# Altium schematic sheet Sheet5_Pin_Headers.SchDoc: JJGEEX_Homie_POC1
size Legal; Author: Jonas Cooper; CompanyName: JJ-GEEX; DrawnBy: Jonas Cooper; Organization: Homie Secure Smarthome; Address1: -; Address2: CU Boulder ECEE; Address3: -; Address4: Capstone; DocumentNumber: 1; Revision: 1; SheetNumber: 4; SheetTotal: 4
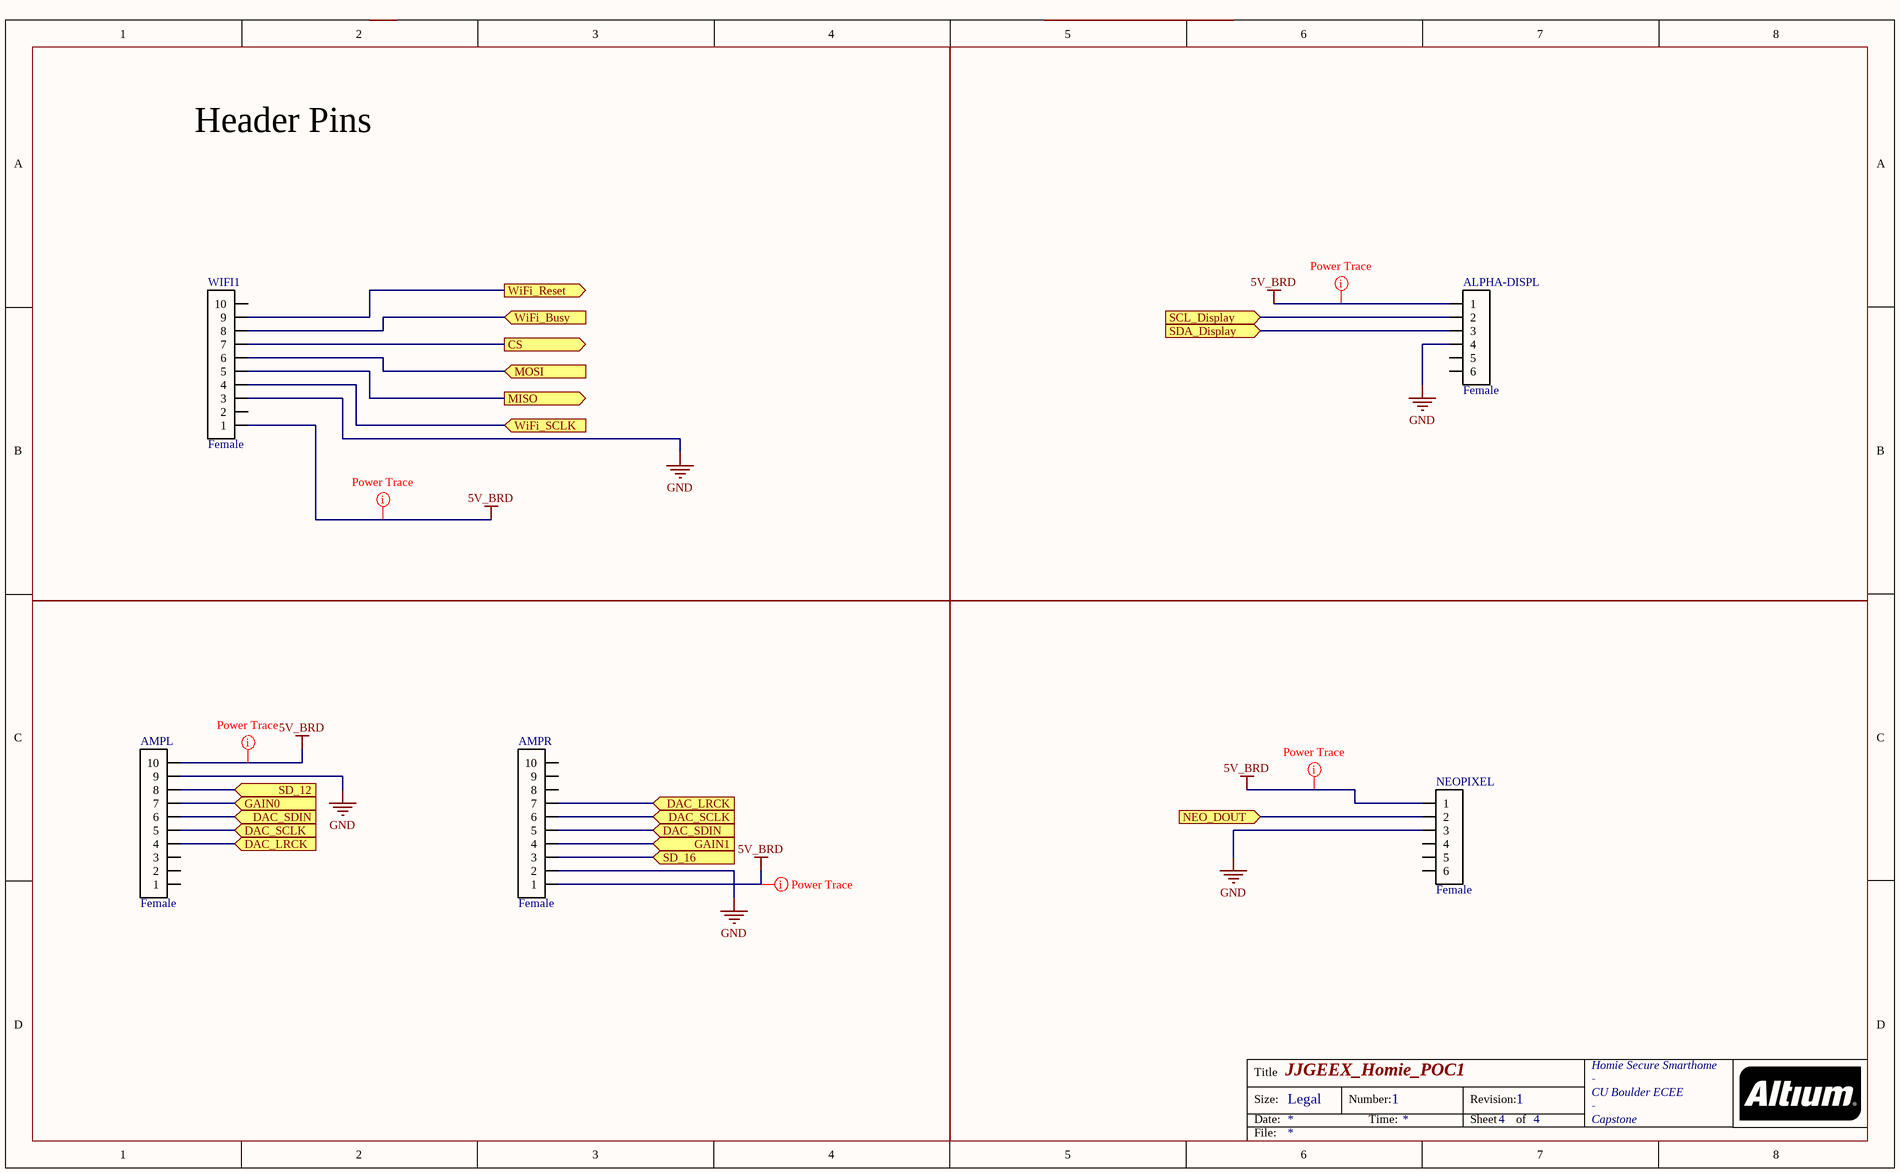
[diagram p0: Sheet5_Pin_Headers.SchDoc]

## Parts
ALPHA-DISPL  value Female  [6_PIN_100MIL]  (hidden comment: PPTC061LFBN-RC)
AMPL  value Female  [10_PIN_100MIL]  (hidden comment: PPTC101LFBN-RC)
AMPR  value Female  [10_PIN_100MIL]  (hidden comment: PPTC101LFBN-RC)
NEOPIXEL  value Female  [6_PIN_100MIL]  (hidden comment: PPTC061LFBN-RC)
WIFI1  value Female  [10_PIN_100MIL]  (hidden comment: PPTC101LFBN-RC)

## Blocks framed on the sheet
Header Pins: WIFI1

## Ports
CS (out), DAC_LRCK (in), DAC_SCLK (in), DAC_SDIN (in), GAIN0 (in), GAIN1 (in), MISO (out), MOSI (in), NEO_DOUT (in), SCL_Display (in), SD_12 (in), SD_16 (in), SDA_Display (in), WiFi_Busy (in), WiFi_Reset (out), WiFi_SCLK (in)

## Nets
5V_BRD: ALPHA-DISPL.1 AMPL.10 AMPR.1 NEOPIXEL.1 WIFI1.1
GND: ALPHA-DISPL.4 AMPL.9 AMPR.2 NEOPIXEL.3 WIFI1.3
CS: WIFI1.7 ; port CS
DAC_LRCK: AMPL.4 AMPR.7 ; port DAC_LRCK
DAC_SCLK: AMPL.5 AMPR.6 ; port DAC_SCLK
DAC_SDIN: AMPL.6 AMPR.5 ; port DAC_SDIN
GAIN0: AMPL.7 ; port GAIN0
GAIN1: AMPR.4 ; port GAIN1
MISO: WIFI1.5 ; port MISO
MOSI: WIFI1.6 ; port MOSI
NEO_DOUT: NEOPIXEL.2 ; port NEO_DOUT
SCL_Display: ALPHA-DISPL.2 ; port SCL_Display
SD_12: AMPL.8 ; port SD_12
SD_16: AMPR.3 ; port SD_16
SDA_Display: ALPHA-DISPL.3 ; port SDA_Display
WiFi_Busy: WIFI1.8 ; port WiFi_Busy
WiFi_Reset: WIFI1.9 ; port WiFi_Reset
WiFi_SCLK: WIFI1.4 ; port WiFi_SCLK

Not connected (* = marked no-connect by the designer): ALPHA-DISPL 5 6; AMPL 1 2 3; AMPR 8 9 10; NEOPIXEL 4 5 6; WIFI1 2 10

## Layout directives
rule Width Constraint [Pref Width = 13mil    Min Width = 6mil    Max Width = 100mil]: 5V_BRD

## Notes on the sheet
- Title
- Size:
- Date:
- Legal
- Number:
- Time:
- Revision:
- Sheet
- of
- File:

## Library data of the parts
ALPHA-DISPL NEOPIXEL = JF_6_PIN_FEMALE: 6 Position Header Connector 0.100" (2.54mm) Through Hole Tin; Digikey Link: https://www.digikey.com/product-detail/en/PPTC061LFBN-RC/S7004-ND/810145/?itemSeq=304982353; Digikey Part: S7004-ND
AMPL AMPR WIFI1 = JF_10_PIN_FEMALE: 10 Position Header Connector 0.100" (2.54mm) Through Hole Tin; Digikey Link: https://www.digikey.com/product-detail/en/PPTC101LFBN-RC/S7008-ND/810149/?itemSeq=304982352; Digikey Part: S7008-ND